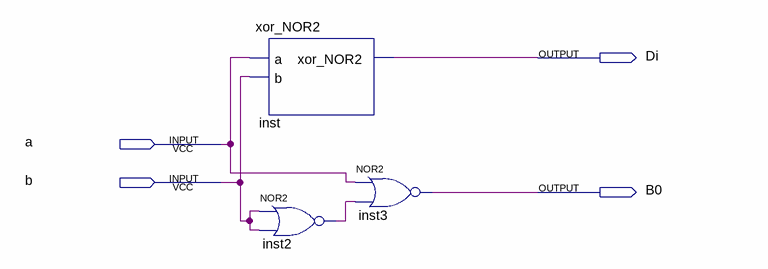
[diagram p0: schematic sheet]
// Quartus schematic semi_minus_NOR2.bdf as structural Verilog: 3 symbols, 4 pins
module semi_minus_NOR2 (
  input  a,
  input  b,
  output Di,
  output B0
);

  wire inst2_out;

  xor_NOR2 inst (.a(a), .b(b), .xor_NOR2(Di));
  nor inst2 (inst2_out, b, b);
  nor inst3 (B0, a, inst2_out);
endmodule
